# Altium schematic sheet divers.SchDoc
size A3
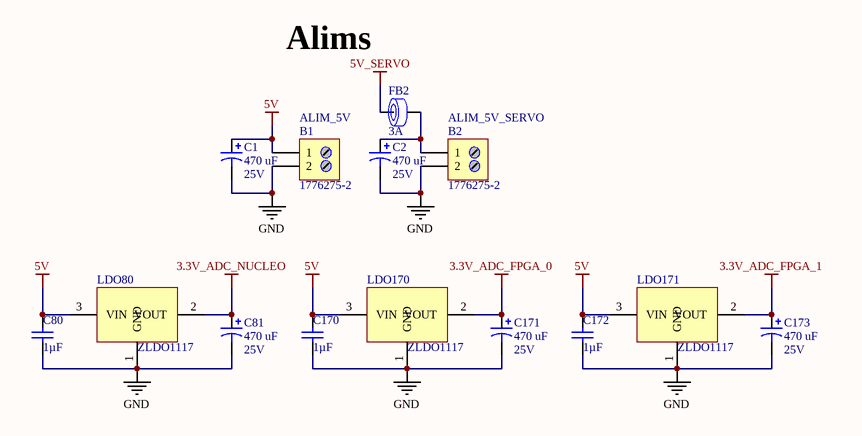
[diagram p0: divers.SchDoc]

## Parts
B1  1776275-2  [BORNIER_2V_3.5MM]
B2  1776275-2  [BORNIER_2V_3.5MM]
C1  470 uF  RatedVoltage: 25V  [WCAP-ATG8_8x11.5x3.5x0.5]
C2  470 uF  RatedVoltage: 25V  [WCAP-ATG8_8x11.5x3.5x0.5]
C80  1µF  [WCAP-CSGP_0603, 1.6x0.8x0.8]
C81  470 uF  RatedVoltage: 25V  [WCAP-ATG8_8x11.5x3.5x0.5]
C170  1µF  [WCAP-CSGP_0603, 1.6x0.8x0.8]
C171  470 uF  RatedVoltage: 25V  [WCAP-ATG8_8x11.5x3.5x0.5]
C172  1µF  [WCAP-CSGP_0603, 1.6x0.8x0.8]
C173  470 uF  RatedVoltage: 25V  [WCAP-ATG8_8x11.5x3.5x0.5]
FB2  RatedCurrent: 3A  [WE-CBF_0805_High Current]  (hidden comment: 742792023)
LDO80  ZLDO1117  [SOT223_M]
LDO170  ZLDO1117  [SOT223_M]
LDO171  ZLDO1117  [SOT223_M]

## Nets
3.3V_ADC_FPGA_0: C171.1 LDO170.2(VOUT)
3.3V_ADC_FPGA_1: C173.1 LDO171.2(VOUT)
3.3V_ADC_NUCLEO: C81.1 LDO80.2(VOUT)
5V: B1.1 C1.1 C80.1 C170.1 C172.1 LDO80.3(VIN) LDO170.3(VIN) LDO171.3(VIN)
5V_SERVO: FB2.1
GND: B1.2 B2.2 C1.2 C2.2 C80.2 C81.2 C170.2 C171.2 C172.2 C173.2 LDO80.1(GND) LDO170.1(GND) LDO171.1(GND)
NetB2_1: B2.1 C2.1 FB2.2

## Notes on the sheet
- Alims
- (near B1) ALIM_5V
- ALIM_5V_SERVO

## Library data of the parts
B1 B2 = 1776275-2: TERM BLOCK 2POS SIDE ENT 3.5MM; Manufacturer: TE Connectivity AMP Connectors; Supplier 1: Farnell; Supplier Part Number 1: 1098611; Manufacturer Part Number: 1776275-2; ComponentLink1URL: http://www.te.com/commerce/DocumentDelivery/DDEController?Action=srchrtrv&DocNm=1776275&DocType=Customer+Drawing&DocLang=English; ComponentLink1Description: http://www.te.com/commerce/DocumentDelivery/DDEController?Action=srchrtrv&DocNm=1776275&DocType=Customer+Drawing&DocLang=English
C1 C2 C81 C171 C173 = WCAP-ATG8, 860010474013: CAP Alu 470 UF 20% 25 V; Manufacturer: Wurth Elektronik; PublishedDate: July 2016; ComponentLink1Description: Manufacturer; ComponentLink1URL: http://www.we-online.de; ComponentLink2Description: Datasheet; ComponentLink2URL: http://katalog.we-online.de/pbs/datasheet/860010474013.pdf; Manufacturer Part Number: 860010474013; Value: 470 uF; Size: 8mmx11.5mm
C80 C170 C172 = WCAP-CSGP, 885012206095: CAP CER 100nF 50V X7R 0603; Manufacturer: Wurth Elektronik; PublishedDate: Aug 2016; ComponentLink1Description: Manufacturer; ComponentLink1URL: http://www.we-online.de; ComponentLink2Description: Datasheet; ComponentLink2URL: http://katalog.we-online.com/pbs/datasheet/885012206095.pdf; Manufacturer Part Number: 885012206095; Value: 100nF; Size: 0603; CeramicType: X7R; RatedVoltage: 50V; ComponentClass: 15_FPGA_US
FB2 = WE-CBF, 742792023: Ferrite Bead 120ohm 0805 max3.0A; Manufacturer: Wurth Elektronik; Value: 120Ω; Type: High Current; PublishedDate: Aug 2016; ComponentLink1Description: Manufacturer; ComponentLink1URL: http://www.we-online.de; ComponentLink2Description: Datasheet; ComponentLink2URL: http://katalog.we-online.de/pbs/datasheet/742792023.pdf; Manufacturer Part Number: 742792023; Size: 0805
LDO80 LDO170 LDO171 = ZLDO1117: Manufacturer: Diodes Incorporated; Manufacturer Part Number: ZLDO1117; Supplier 1: fr.farnell; Supplier Part Number 1: 1825376